# Altium schematic sheet PWM_To_Analogue.SchDoc
size A4; Organization: Altium Limited; Address1: L3, 12a Rodborough Rd; Address2: Frenchs Forest; Address3: NSW; Address4: Australia 2086
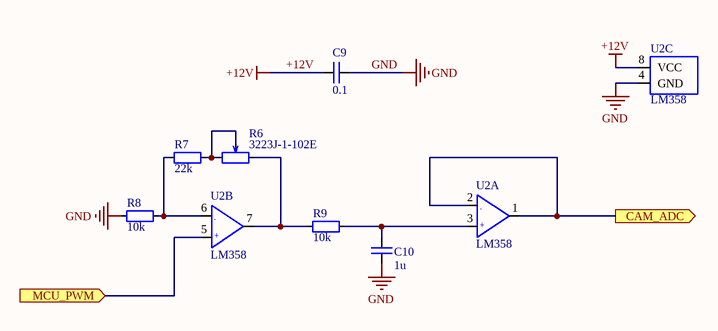
[diagram p0: PWM_To_Analogue.SchDoc]

## Parts
(Parts that share a designator on the sheet are numbered #1, #2 ... from top to bottom, then left to right.)
C9  0.1  [CAP_0603]
C10  1u  [CAP_0603]
R6  3223J-1-102E  [RES-ADJ-SMD-Panasonic]
R7  22k  [SMD_0603]
R8  10k  [SMD_0603]
R9  10k  [SMD_0603]
U2#1  LM358  [SO8-150mil]  (part A of 2)
U2#2  LM358  [SO8-150mil]  (parts B,C of 3)

## Ports
CAM_ADC (out), MCU_PWM (in)

## Nets
+12V: C9.1 U2#2.8(VCC)
GND: C9.2 C10.2 R8.2 U2#2.4(GND)
CAM_ADC: U2#1.1 U2#1.2 ; port CAM_ADC
MCU_PWM: U2#2.5 ; port MCU_PWM
NetC10_1: C10.1 R9.1 U2#1.3
NetR6_1: R6.1 R6.3 R7.1
NetR6_2: R6.2 R9.2 U2#2.7
NetR7_2: R7.2 R8.1 U2#2.6

Not connected (* = marked no-connect by the designer): U2#1 4 8

## Notes on the sheet
- Title
- Size:
- Date:
- A4
- Number:
- Time:
- Revision:
- Sheet
- of
- File:
- (in symbol LM358, part A) -; +
- (in symbol LM358, part B) -; +

## Library data of the parts
C9 C10 = C_NONE_POLAR: None polar capacitor; Case: 0805
  C9: Value: 0.1
  C10: Value: 1u
R6 = RES_ADJ: Agjustable resistor; Value: 3223J-1-102E
R7-R9 = RES: Resistor
  R7: Value: 22k; Case: 0805
  R8: Value: 10k; Case: *
  R9: Value: 10k; Case: 0805
U2#1 U2#2 = LM358: OpAmp; Manufacture: TI; Case: SOIC-8; HelpURL: http://www.ti.com/lit/ds/symlink/lm158-n.pdf; Model: LM358